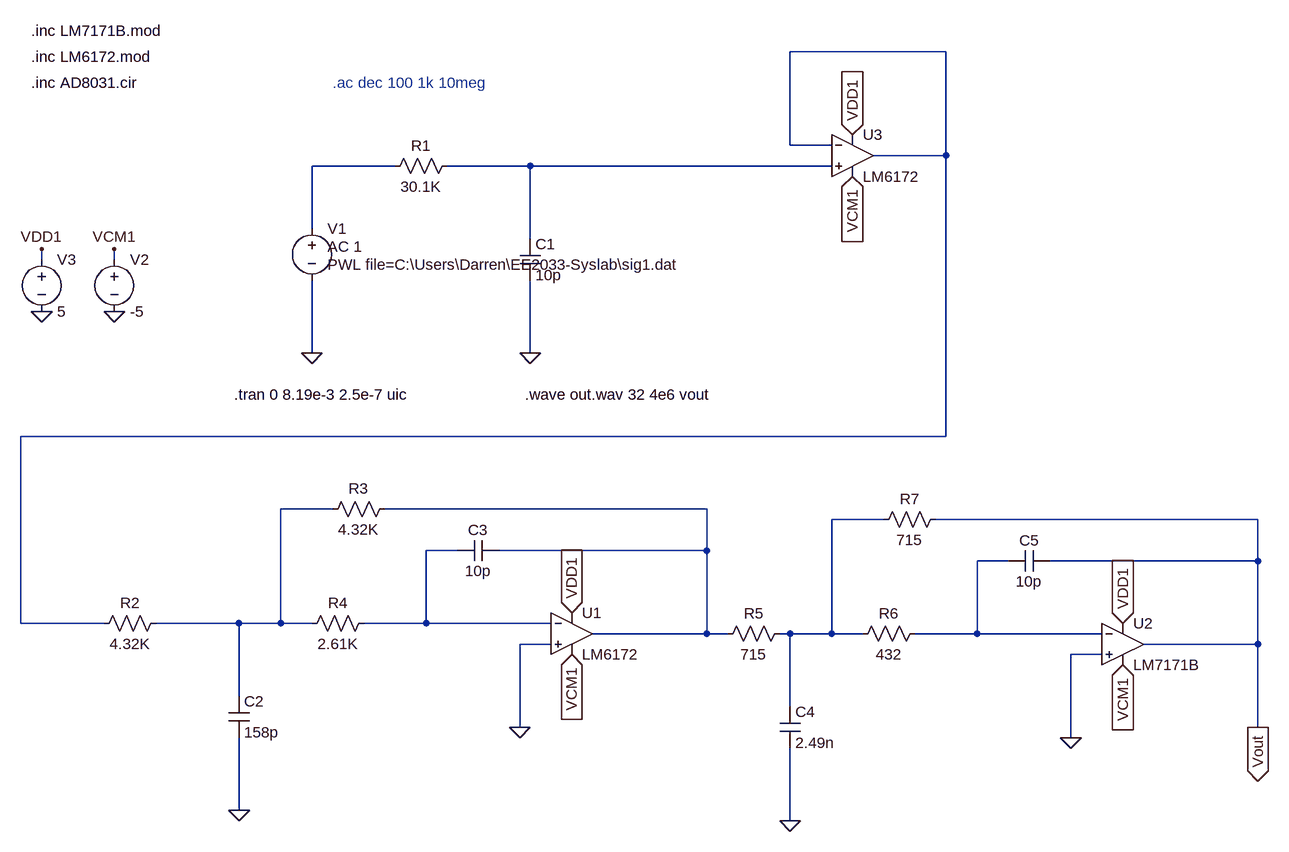
[diagram p0: schematic 5db-182-198-3stage-5order.asc]
5db-182-198-3stage-5order.asc, the LTspice schematic file:
Version 4
SHEET 1 2036 680
WIRE 1280 -736 1040 -736
WIRE 1040 -592 1040 -736
WIRE 1104 -592 1040 -592
WIRE 1280 -576 1280 -736
WIRE 1280 -576 1168 -576
WIRE 432 -560 304 -560
WIRE 640 -560 512 -560
WIRE 1104 -560 640 -560
WIRE 304 -464 304 -560
WIRE 640 -448 640 -560
WIRE -112 -416 -112 -432
WIRE 0 -416 0 -432
WIRE 304 -272 304 -384
WIRE 640 -272 640 -384
WIRE 1280 -144 1280 -576
WIRE 1280 -144 -144 -144
WIRE 336 -32 256 -32
WIRE 912 -32 416 -32
WIRE 1184 -16 1104 -16
WIRE 1760 -16 1264 -16
WIRE 528 32 480 32
WIRE 912 32 912 -32
WIRE 912 32 592 32
WIRE 1376 48 1328 48
WIRE 1760 48 1760 -16
WIRE 1760 48 1440 48
WIRE -144 144 -144 -144
WIRE -16 144 -144 144
WIRE 192 144 64 144
WIRE 256 144 256 -32
WIRE 256 144 192 144
WIRE 304 144 256 144
WIRE 480 144 480 32
WIRE 480 144 384 144
WIRE 672 144 480 144
WIRE 912 160 912 32
WIRE 912 160 736 160
WIRE 944 160 912 160
WIRE 1040 160 1024 160
WIRE 1104 160 1104 -16
WIRE 1104 160 1040 160
WIRE 1152 160 1104 160
WIRE 1328 160 1328 48
WIRE 1328 160 1232 160
WIRE 1520 160 1328 160
WIRE 672 176 624 176
WIRE 1760 176 1760 48
WIRE 1760 176 1584 176
WIRE 1520 192 1472 192
WIRE 192 256 192 144
WIRE 1040 272 1040 160
WIRE 624 304 624 176
WIRE 1760 304 1760 176
WIRE 1472 320 1472 192
WIRE 192 432 192 320
WIRE 1040 448 1040 336
FLAG 192 432 0
FLAG 624 304 0
FLAG 704 128 VDD1
IOPIN 704 128 In
FLAG 704 192 VCM1
IOPIN 704 192 In
FLAG -112 -336 0
FLAG 0 -336 0
FLAG -112 -432 VDD1
FLAG 0 -432 VCM1
FLAG 1040 448 0
FLAG 1472 320 0
FLAG 1552 144 VDD1
IOPIN 1552 144 In
FLAG 1552 208 VCM1
IOPIN 1552 208 In
FLAG 1760 304 Vout
IOPIN 1760 304 Out
FLAG 640 -272 0
FLAG 304 -272 0
FLAG 1136 -608 VDD1
IOPIN 1136 -608 In
FLAG 1136 -544 VCM1
IOPIN 1136 -544 In
SYMBOL res 80 128 R90
WINDOW 0 0 56 VBottom 2
WINDOW 3 32 56 VTop 2
SYMATTR InstName R2
SYMATTR Value 4.32K
SYMBOL cap 592 16 R90
WINDOW 0 0 32 VBottom 2
WINDOW 3 32 32 VTop 2
SYMATTR InstName C3
SYMATTR Value 10p
SYMBOL res 432 -48 R90
WINDOW 0 0 56 VBottom 2
WINDOW 3 32 56 VTop 2
SYMATTR InstName R3
SYMATTR Value 4.32K
SYMBOL res 400 128 R90
WINDOW 0 0 56 VBottom 2
WINDOW 3 32 56 VTop 2
SYMATTR InstName R4
SYMATTR Value 2.61K
SYMBOL cap 176 320 M180
WINDOW 0 24 56 Left 2
WINDOW 3 24 8 Left 2
SYMATTR InstName C2
SYMATTR Value 158p
SYMBOL voltage 0 -432 R0
WINDOW 123 0 0 Left 0
WINDOW 39 0 0 Left 0
SYMATTR InstName V2
SYMATTR Value -5
SYMBOL OpAmps\\opamp2 704 96 R0
SYMATTR InstName U1
SYMATTR Value LM6172
SYMBOL voltage -112 -432 R0
WINDOW 123 0 0 Left 0
WINDOW 39 0 0 Left 0
SYMATTR InstName V3
SYMATTR Value 5
SYMBOL res 1040 144 R90
WINDOW 0 0 56 VBottom 2
WINDOW 3 32 56 VTop 2
SYMATTR InstName R5
SYMATTR Value 715
SYMBOL cap 1440 32 R90
WINDOW 0 0 32 VBottom 2
WINDOW 3 32 32 VTop 2
SYMATTR InstName C5
SYMATTR Value 10p
SYMBOL res 1280 -32 R90
WINDOW 0 0 56 VBottom 2
WINDOW 3 32 56 VTop 2
SYMATTR InstName R7
SYMATTR Value 715
SYMBOL res 1248 144 R90
WINDOW 0 0 56 VBottom 2
WINDOW 3 32 56 VTop 2
SYMATTR InstName R6
SYMATTR Value 432
SYMBOL cap 1024 336 M180
WINDOW 0 24 56 Left 2
WINDOW 3 24 8 Left 2
SYMATTR InstName C4
SYMATTR Value 2.49n
SYMBOL OpAmps\\opamp2 1552 112 R0
SYMATTR InstName U2
SYMATTR Value LM7171B
SYMBOL res 528 -576 R90
WINDOW 0 0 56 VBottom 2
WINDOW 3 32 56 VTop 2
SYMATTR InstName R1
SYMATTR Value 30.1K
SYMBOL cap 624 -384 M180
WINDOW 0 24 56 Left 2
WINDOW 3 24 8 Left 2
SYMATTR InstName C1
SYMATTR Value 10p
SYMBOL OpAmps\\opamp2 1136 -640 R0
SYMATTR InstName U3
SYMATTR Value LM6172
SYMBOL voltage 304 -480 R0
WINDOW 3 24 72 Left 2
WINDOW 123 24 44 Left 2
WINDOW 39 24 72 Left 2
SYMATTR Value PWL file=C:\Users\Darren\EE2033-Syslab\sig1.dat
SYMATTR Value2 AC 1
SYMATTR InstName V1
TEXT -128 -768 Left 2 !.inc LM7171B.mod
TEXT -128 -728 Left 2 !.inc LM6172.mod
TEXT -128 -688 Left 2 !.inc AD8031.cir
TEXT 184 -208 Left 2 !.tran 0 8.19e-3 2.5e-7 uic
TEXT 632 -208 Left 2 !.wave out.wav 32 4e6 vout
TEXT 336 -688 Left 2 ;.ac dec 100 1k 10meg

The netlist it stands for:
* 5db-182-198-3stage-5order.asc
R2 N004 N001 4.32K
C3 N005 N007 10p
R3 N005 N004 4.32K
R4 N007 N004 2.61K
C2 0 N004 158p
V2 VCM1 0 -5
XU1 0 N007 VDD1 VCM1 N005 LM6172  ; pins In+ In- V+ V- OUT
V3 VDD1 0 5
R5 N006 N005 715
C5 Vout N008 10p
R7 Vout N006 715
R6 N008 N006 432
C4 0 N006 2.49n
XU2 0 N008 VDD1 VCM1 Vout LM7171B  ; pins In+ In- V+ V- OUT
R1 N003 N002 30.1K
C1 0 N003 10p
XU3 N003 N001 VDD1 VCM1 N001 LM6172  ; pins In+ In- V+ V- OUT
V1 N002 0 PWL file=C:\Users\Darren\EE2033-Syslab\sig1.dat AC 1
.inc LM7171B.mod
.inc LM6172.mod
.inc AD8031.cir
.tran 0 8.19e-3 2.5e-7 uic
.wave out.wav 32 4e6 vout
* .ac dec 100 1k 10meg
.backanno
.end